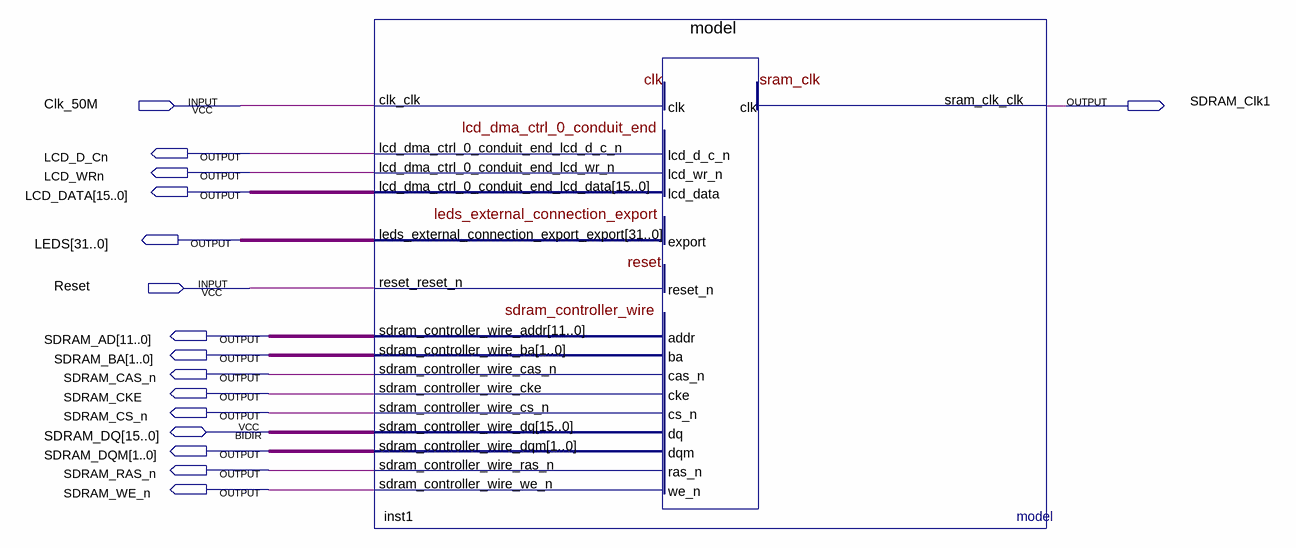
[diagram p0: schematic sheet]
// Quartus schematic labo1.bdf as structural Verilog: 1 symbols, 16 pins
module labo1 (
  input  Clk_50M,
  input  Reset,
  inout  [15:0] SDRAM_DQ,
  output SDRAM_Clk1,
  output LCD_D_Cn,
  output LCD_WRn,
  output [15:0] LCD_DATA,
  output [31:0] LEDS,
  output [11:0] SDRAM_AD,
  output [1:0] SDRAM_BA,
  output SDRAM_CAS_n,
  output SDRAM_CKE,
  output SDRAM_CS_n,
  output [1:0] SDRAM_DQM,
  output SDRAM_RAS_n,
  output SDRAM_WE_n
);

  model inst1 (
    .clk_clk(Clk_50M), .reset_reset_n(Reset), .lcd_dma_ctrl_0_conduit_end_lcd_d_c_n(LCD_D_Cn),
    .lcd_dma_ctrl_0_conduit_end_lcd_wr_n(LCD_WRn), .lcd_dma_ctrl_0_conduit_end_lcd_data(LCD_DATA),
    .sdram_controller_wire_addr(SDRAM_AD), .sdram_controller_wire_ba(SDRAM_BA),
    .sdram_controller_wire_cas_n(SDRAM_CAS_n), .sdram_controller_wire_cke(SDRAM_CKE),
    .sdram_controller_wire_cs_n(SDRAM_CS_n), .sdram_controller_wire_dqm(SDRAM_DQM),
    .sdram_controller_wire_ras_n(SDRAM_RAS_n), .sdram_controller_wire_we_n(SDRAM_WE_n),
    .sram_clk_clk(SDRAM_Clk1), .leds_external_connection_export_export(LEDS),
    .sdram_controller_wire_dq(SDRAM_DQ));
endmodule
